# Altium schematic sheet Gagabiro_mechanical.SchDoc
size 393 x 281 mm; SheetNumber: 4; SheetTotal: 4
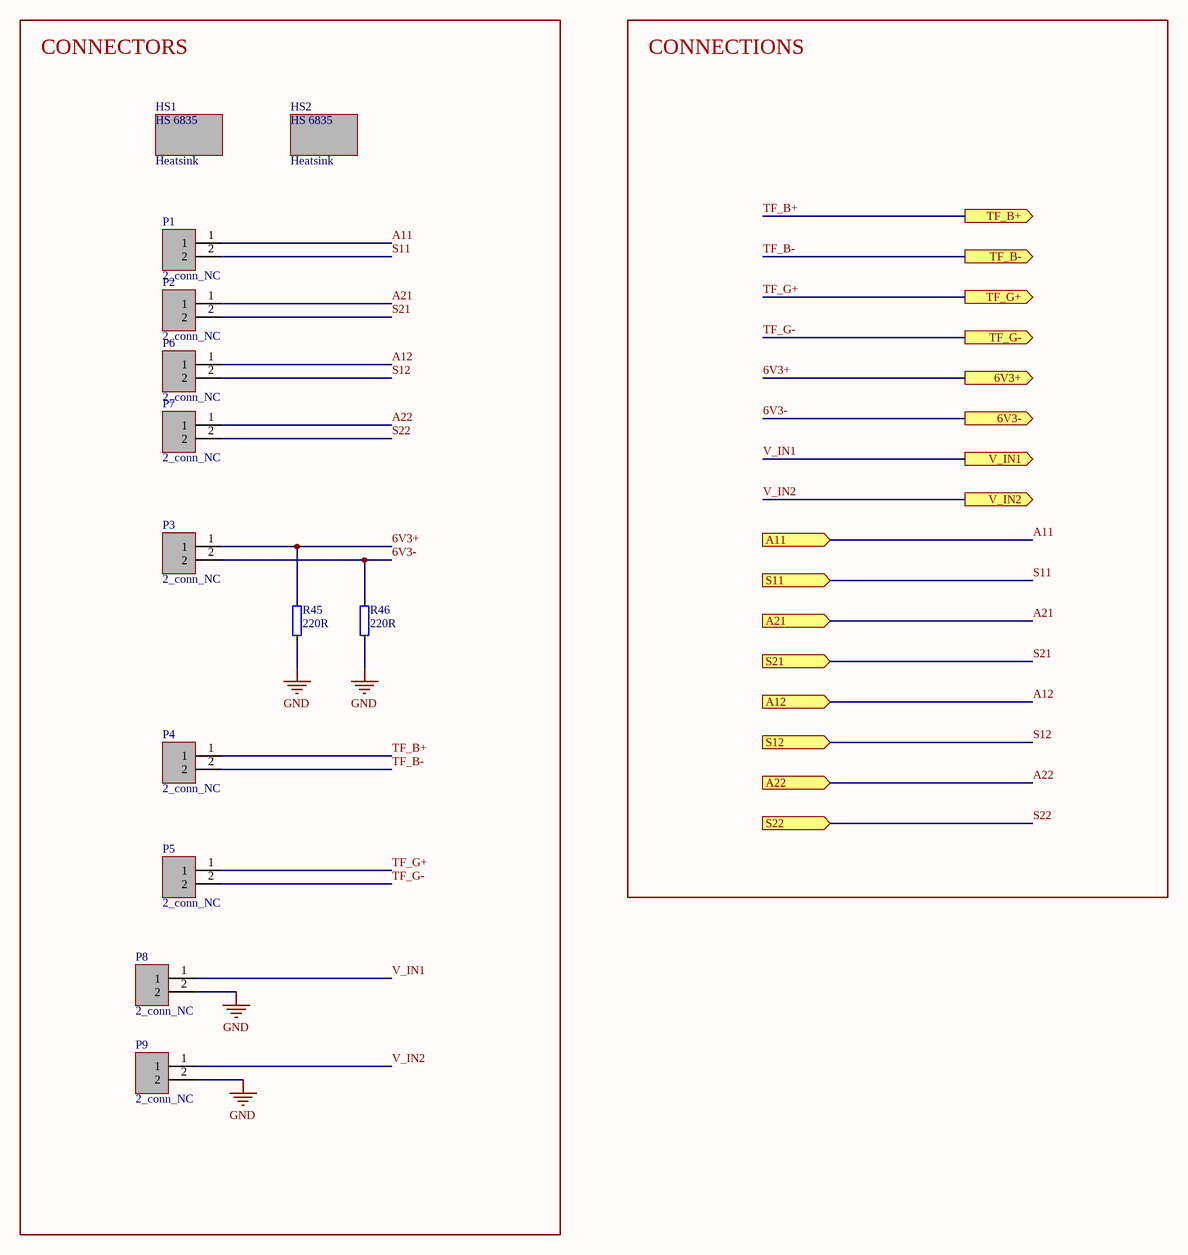
[diagram p0: Gagabiro_mechanical.SchDoc]

## Parts
HS1  Heatsink  [heatsink_HS_6835]
HS2  Heatsink  [heatsink_HS_6835]
P1  2_conn_NC  [2_conn_NC]
P2  2_conn_NC  [2_conn_NC]
P3  2_conn_NC  [2_conn_NC]
P4  2_conn_NC  [2_conn_NC]
P5  2_conn_NC  [2_conn_NC]
P6  2_conn_NC  [2_conn_NC]
P7  2_conn_NC  [2_conn_NC]
P8  2_conn_NC  [2_conn_NC]
P9  2_conn_NC  [2_conn_NC]
R45  220R  [RES_2W_vertical]
R46  220R  [RES_2W_vertical]

## Blocks framed on the sheet
CONNECTORS: HS1 HS2 P1-P9 R45 R46

## Ports
6V3+ (out, see Gagabiro_cover_letter[2C], Gagabiro_main[2C]), 6V3- (out, see Gagabiro_cover_letter[2C], Gagabiro_main[2C]), A11 (in, see Gagabiro_cover_letter[2C]), A12 (in, see Gagabiro_cover_letter[2C]), A21 (in, see Gagabiro_cover_letter[2C]), A22 (in, see Gagabiro_cover_letter[2C]), S11 (in, see Gagabiro_cover_letter[2C]), S12 (in, see Gagabiro_cover_letter[2C]), S21 (in, see Gagabiro_cover_letter[2C]), S22 (in, see Gagabiro_cover_letter[2C]), TF_B+ (out, see Gagabiro_cover_letter[2C], Gagabiro_power_supply[1D]), TF_B- (out, see Gagabiro_cover_letter[2C], Gagabiro_power_supply[1D]), TF_G+ (out, see Gagabiro_cover_letter[2C], Gagabiro_power_supply[1D]), TF_G- (out, see Gagabiro_cover_letter[2C], Gagabiro_power_supply[1D]), V_IN1 (out, see Gagabiro_cover_letter[2C]), V_IN2 (out, see Gagabiro_cover_letter[2C])

## Nets
GND: P8.2 P9.2 R45.1 R46.1
6V3+: P3.1 R45.2 ; port 6V3+
6V3-: P3.2 R46.2 ; port 6V3-
A11: P1.1 ; port A11
A12: P6.1 ; port A12
A21: P2.1 ; port A21
A22: P7.1 ; port A22
S11: P1.2 ; port S11
S12: P6.2 ; port S12
S21: P2.2 ; port S21
S22: P7.2 ; port S22
TF_B+: P4.1 ; port TF_B+
TF_B-: P4.2 ; port TF_B-
TF_G+: P5.1 ; port TF_G+
TF_G-: P5.2 ; port TF_G-
V_IN1: P8.1 ; port V_IN1
V_IN2: P9.1 ; port V_IN2

## Notes on the sheet
- CONNECTIONS
- Title:
- Drawn By:
- Size:
- Date:
- File:
- A3
- Number:
- Time:
- Revision:
- Sheet
- of
- Website:

## Library data of the parts
HS1 HS2 = HS 6835
P1-P9 = 2_conn_NC: Connector Header Surface Mount, Right Angle 2 position 0.079 (2.00mm); MP: S2B-PH-SM4-TB; MF: JST Sales; Price: None; Availability: In Stock; Package: None; Value: *; SnapEDA_Link: https://www.snapeda.com/parts/S2B-PH-SM4-TB/JST+Sales+America+Inc./view-part/?ref=snap; Purchase-URL: https://pricing.snapeda.com/search/part/S2B-PH-SM4-TB/?ref=eda; Check_prices: https://www.snapeda.com/parts/S2B-PH-SM4-TB/JST+Sales+America+Inc./view-part/?ref=eda
R45 R46 = R_2W_vertical_220R: Resistor, 2W; Part Number: R2W; ComponentLink1URL: N.A.; ComponentLink1Description: Datasheet; ComponentLink2URL: N.A.; ComponentLink2Description: Supplier link; Author: colombari; Value: 220R